# Altium schematic sheet Main_Schematics.SchDoc
size A3; SheetNumber: 1; SheetTotal: 1; SPICEModelCacheYWMZKGYA: <root> / <DocumentId>YWMZKGYA</DocumentId> / <CacheFrame Number="0"> / <Model Name="mcp6021" Kind="CKT"> / <Text>.SUBCKT MCP6021 1 2 3 4 5 / *               | | | | | / *               | | | | Output / *               | | | Negative Supply / *               | | Positive Supply / *               | Inverting Input / *               Non-inverting Input / * / ******************************************************************************** / * Software License Agreement                                                   * / *                                                                              * / * The software supplied herewith by Microchip Technology Incorporated (the     * / * 'Company') is intended and supplied to you, the Company's customer, for use  * / * soley and exclusively on Microchip products.                                 * / *                                                                              * / * The software is owned by the Company and/or its supplier, and is protected   * / * under applicable copyright laws. All rights are reserved. Any use in         * / * violation of the foregoing restrictions may subject the user to criminal     * / * sanctions under applicable laws, as well as to civil liability for the       * / * breach of the terms and conditions of this license.                          * / *                                                                              * / * THIS SOFTWARE IS PROVIDED IN AN 'AS IS' CONDITION. NO WARRANTIES, WHETHER    * / * EXPRESS, IMPLIED OR STATUTORY, INCLUDING, BUT NOT LIMITED TO, IMPLIED        * / * WARRANTIES OF MERCHANTABILITY AND FITNESS FOR A PARTICULAR PURPOSE APPLY TO  * / * THIS SOFTWARE. THE COMPANY SHALL NOT, IN ANY CIRCUMSTANCES, BE LIABLE FOR    * / * SPECIAL, INCIDENTAL OR CONSEQUENTIAL DAMAGES, FOR ANY REASON WHATSOEVER.     * / ******************************************************************************** / * / * The following op-amps are covered by this model: / *      MCP6021,MCP6021R,MCP6022,MCP6023,MCP6024 / * / * Revision History: / *     REV A: 10-Feb-01, KEB (created model) / *     REV B: 27-Aug-06, HNV (added over temperature, improved output stage, / *                            fixed overdrive recovery time) / *			    (MC_RQ, 27-Aug-06, Level 1.17) / * / * Recommendations: / *      Use PSPICE (other simulators may require translation) / *      For a quick, effective design, use a combination of: data sheet / *            specs, bench testing, and simulations with this macromodel / *      For high impedance circuits, set GMIN=100F in the .OPTIONS statement / * / * Supported: / *      Typical performance for temperature range (-40 to 125) degrees Celsius / *      DC, AC, Transient, and Noise analyses. / *      Most specs, including: offsets, DC PSRR, DC CMRR, input impedance, / *            open loop gain, voltage ranges, supply current, ... , etc. / *      Temperature effects for Ibias, Iquiescent, Iout short circuit / *            current, Vsat on both rails, Slew Rate vs. Temp and P.S. / * / * Not Supported: / *      Chip select (MCP6023) / *      Some Variation in specs vs. Power Supply Voltage / *      Monte Carlo (Vos, Ib), Process variation / *      Distortion (detailed non-linear behavior) / *      Behavior outside normal operating region / * / * Input Stage / V10  3 10 -500M / R10 10 11 690K / R11 10 12 690K / G10 10 11 10 11 288U / G11 10 12 10 12 288U / C11 11 12 0.2P / C12  1  0 6.00P / E12 71 14 POLY(4) 20 0 21 0 26 0 27 0   0 1 1 1 1 / G12 1 0 62 0 1m / M12 11 14 15 15 NMI / G13 1 2 62 0 .08m / M14 12 2 15 15 NMI / G14 2 0 62 0 1m / C14  2  0 6.00P / I15 15 4 225.0U / V16 16 4 -300M / GD16 16 1 TABLE {V(16,1)} ((-100,-1p)(0,0)(1m,1u)(2m,1m)) / V13 3 13 -300M / GD13 2 13 TABLE {V(2,13)} ((-100,-1p)(0,0)(1m,1u)(2m,1m)) / R71  1  0 20.0E12 / R72  2  0 20.0E12 / R73  1  2 20.0E12 / I80  1  2 500E-15 / * / * Noise, PSRR, and CMRR / I20 21 20 423U / D20 20  0 DN1 / D21  0 21 DN1 / G26  0 26 POLY(2) 3 0 4 0   0.00 -31.6U -79.4U / R26 26  0 1 / E271 275 0 1 0 1 / E272 276 0 2 0 1 / R271 275 271 37k / R272 276 272 37k / R273 271 0 1k / R274 272 0 1k / C271 275 271 3p / C272 276 272 3p / G27  0 27 POLY(2) 271 0 272 0  -327U 500U 500U / R27 27  0 1 / * / * Open Loop Gain, Slew Rate / G30  0 30 12 11 1 / R30 30  0 1.00K / G31 0 31 3 4 4 / I31 0 31 DC 76.9 / R31 31  0 1 TC=2.34M,-4.57U / GD31 30 0 TABLE {V(30,31)} ((-100,-1n)(0,0)(1m,0.1)(2m,2)) / G32 32 0 3 4 10 / I32 32 0 DC 65 / R32 32  0 1 TC=1.80M,-3.97U / GD32 0 30 TABLE {V(30,32)} ((-2m,2)(-1m,0.1)(0,0)(100,-1n)) / G33  0 33 30 0 1m / R33  33 0 1K / G34  0 34 33 0 1.00 / R34  34 0 1K / C34  34 0 14U / G37  0 37 34 0 1m / R37  37 0 1K / C37  37 0 6P / G38  0 38 37 0 1m / R38  39 0 1K / L38  38 39 31U / E38  35 0 38 0 1 / G35 33 0 TABLE {V(35,3)} ((-1,-1n)(0,0)(50.0,1n))(55.0,1)) / G36 33 0 TABLE {V(35,4)} ((-55.0,-1)((-50.0,-1n)(0,0)(1,1n)) / * / * Output Stage / R80 50 0 100MEG / G50 0 50 57 96 2 / R58 57  96 0.50 / R57 57  0 500 / C58  5  0 2.00P / G57  0 57 POLY(3) 3 0 4 0 35 0   0 0.75M 0.8M 2.00M / GD55 55 57 TABLE {V(55,57)} ((-2m,-1)(-1m,-1m)(0,0)(10,1n)) / GD56 57 56 TABLE {V(57,56)} ((-2m,-1)(-1m,-1m)(0,0)(10,1n)) / E55 55  0 POLY(2) 3 0 51 0 -1.4M 1 -19.1M / E56 56  0 POLY(2) 4 0 52 0 3.5M 1 -19.0M / R51 51 0 1k / R52 52 0 1k / GD51 50 51 TABLE {V(50,51)} ((-10,-1n)(0,0)(1m,1m)(2m,1)) / GD52 50 52 TABLE {V(50,52)}  ((-2m,-1)(-1m,-1m)(0,0)(10,1n)) / G53  3  0 POLY(1) 51 0  -50.0U 1M / G54  0  4 POLY(1) 52 0  -50.0U -1M / * / * Current Limit / G99 96 5 99 0 1 / R98 0 98 1 TC=3.18M,-842N / G97 0 98 TABLE { V(96,5) } ((-11.0,-23.0M)(-1.00M,-22.7M)(0,0)(1.00M,22.7M)(11.0,23.0M)) / E97 99 0 VALUE { V(98)*((V(3)-V(4))*0.00 + 1.00)} / D98 4 5 DESD / D99 5 3 DESD / * / * Temperature / Voltage Sensitive IQuiscent / R61 0 61 1 TC=2.62M,-1.92U / G61 3 4 61 0 1 / G60 0 61 TABLE {V(3, 4)} / + ((0,0)(900M,9.2U)(1.1,50U)(1.3,240U) / + (2.1,870U)(2.2,900U)(5.5,980U)) / * / * Temperature Sensistive offset voltage / I73 0 70 DC 1uA / R74 0 70 1 TC=3.5 / E75 1 71 70 0 1 / * / * Temp Sensistive IBias / I62 0 62 DC 1uA / R62 0 62 REXP  245U / * / * Models / .MODEL NMI NMOS(L=2.00U W=42.0U KP=20.0U LEVEL=1 ) / .MODEL DESD  D   N=1 IS=1.00E-15 / .MODEL DN1 D   IS=1P KF=12.5F AF=1 / .MODEL REXP RES TCE= 9.16 / .ENDS MCP6021</Text> / </Model> / </CacheFrame> / </root>
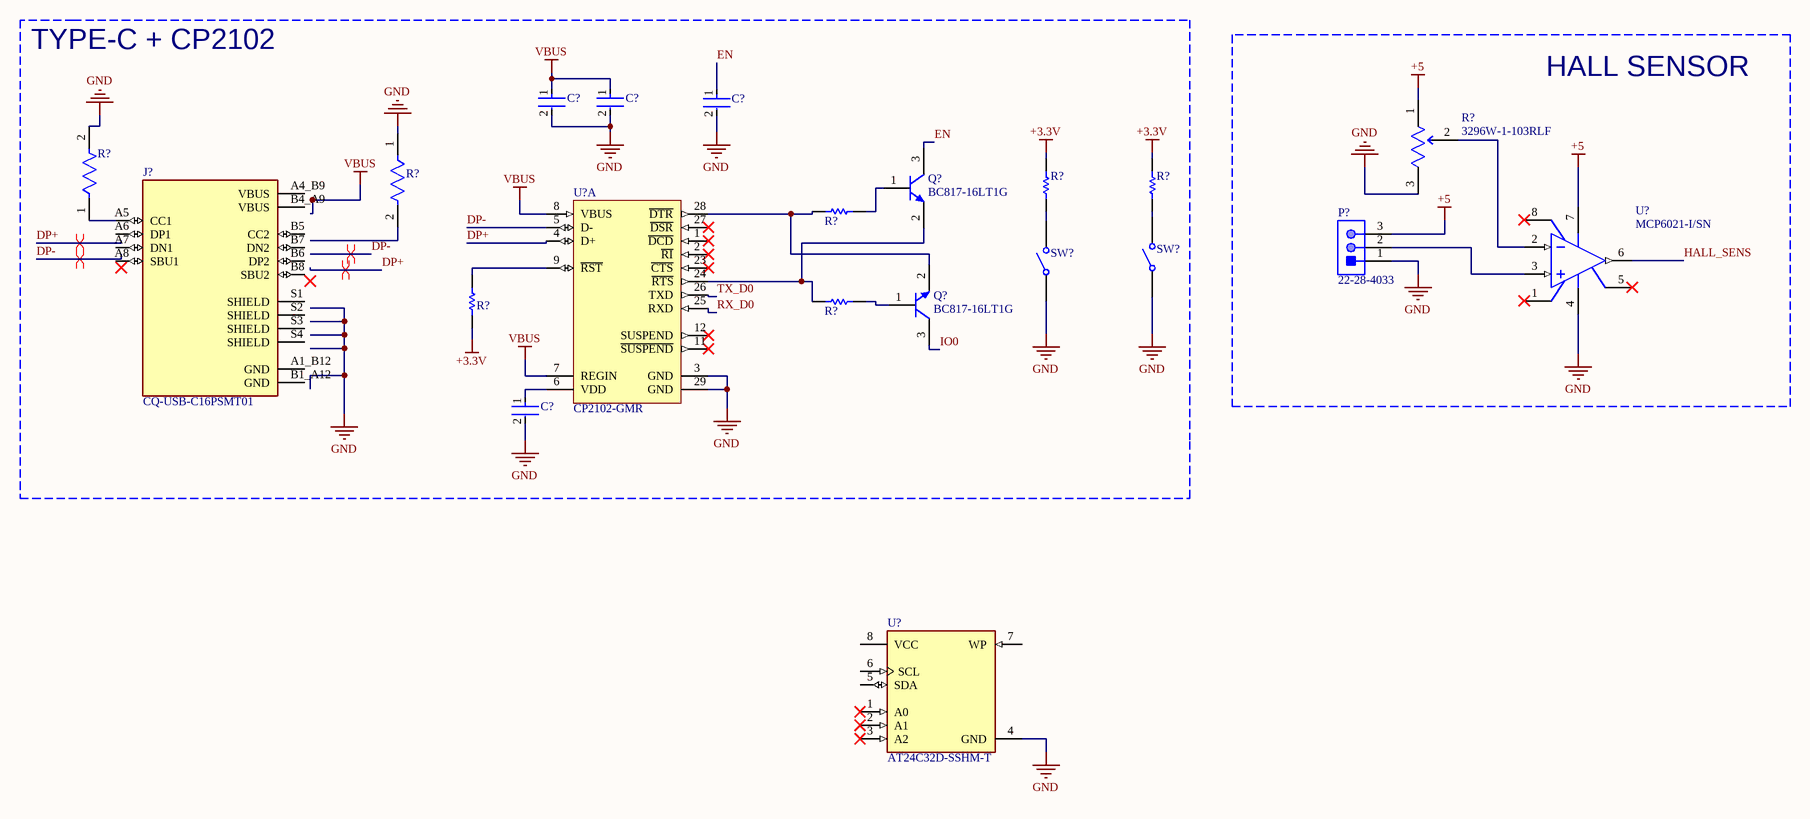
[diagram p0: Main_Schematics.SchDoc]

## Parts
(Parts that share a designator on the sheet are numbered #1, #2 ... from top to bottom, then left to right.)
C?#1  CGA3E2X7R1H104K080AA  [FP-CGA3E-0_3-0_1-IPC_A]  (value not drawn)
C?#2  C0603C475K9PACTU  [FP-C0603-CG-MFG]  (value not drawn)
C?#3  CGA3E2X7R1H104K080AA  [FP-CGA3E-0_3-0_1-IPC_A]  (value not drawn)
C?#4  CGA3E2X7R1H104K080AA  [FP-CGA3E-0_3-0_1-IPC_A]  (value not drawn)
J?  CQ-USB-C16PSMT01  [SHENZHEN-CHUANGQIN-TECHNOLOGY_CQ-USB-C16PSMT01]
P?  22-28-4033  [MOLX-22-28-4033_V]
Q?#1  BC817-16LT1G  [ONSC-SOT-23-3-318-08_V]
Q?#2  BC817-16LT1G  [ONSC-SOT-23-3-318-08_V]
R?#1  3296W-1-103RLF  [FP-3296W-MFG]
R?#2  CRCW06035K10FKEA  [FP-CRCW0603-e3-IPC_C]  (value not drawn)
R?#3  ERJ3EKF1002V  [RESC1609X55X30LL15T15]  (value not drawn)
R?#4  ERJ3EKF1002V  [RESC1609X55X30LL15T15]  (value not drawn)
R?#5  ERJ3EKF1002V  [RESC1609X55X30LL15T15]  (value not drawn)
R?#6  CRCW06035K10FKEA  [FP-CRCW0603-e3-IPC_C]  (value not drawn)
R?#7  ERJ3EKF1002V  [RESC1609X55X30LL15T15]  (value not drawn)
R?#8  ERJ3EKF1002V  [RESC1609X55X30LL15T15]  (value not drawn)
SW?#1  434121043816  [434121043816]  (value not drawn)
SW?#2  434121043816  [434121043816]  (value not drawn)
U?#1  CP2102-GMR  [SLAB-QFN-28-3125x3125TP_M]  (part A of 2)
U?#2  MCP6021-I/SN  [SOIC-SN8_L]
U?#3  AT24C32D-SSHM-T  [FP-C04-057-SN-IPC_C]

## Blocks framed on the sheet
TYPE-C + CP2102: C?#1-C?#4 J? Q?#1 Q?#2 R?#2-R?#8 SW?#1 SW?#2 U?#1
HALL SENSOR: P? R?#1 U?#2

## Nets
+3.3V: R?#3.2 R?#4.2 R?#8.1
+5: P?.3 R?#1.1(CCW) U?#2.7(VDD)
GND: C?#1.2 C?#2.2 C?#3.2 C?#4.2 P?.1 R?#1.3(CW) R?#2.1 R?#6.2 SW?#1.1 SW?#2.1 U?#1.3(GND) U?#1.29(GND) U?#2.4(VSS) U?#3.4(GND)
VBUS: C?#1.1 C?#2.1 U?#1.7(REGIN) U?#1.8(VBUS)
DP+: U?#1.4(D+)
DP-: U?#1.5(D-)
EN: C?#3.1 Q?#1.3(C)
HALL_SENS: U?#2.6(VOUT)
IO0: Q?#2.3(C)
RX_D0: U?#1.25(RXD)
TX_D0: U?#1.26(TXD)
NetC?#4_1: C?#4.1 U?#1.6(VDD)
NetJ?_A5: J?.A5(CC1) R?#6.1
NetP?_2: P?.2 U?#2.3(VIN+)
NetQ?#1_1: Q?#1.1(B) R?#5.1
NetQ?#1_2: Q?#1.2(E) R?#7.2 U?#1.24(~{RTS})
NetQ?#2_1: Q?#2.1(B) R?#7.1
NetQ?#2_2: Q?#2.2(E) R?#5.2 U?#1.28(~{DTR})
NetR?#1_2: R?#1.2(WIPER) U?#2.2(VIN-)
NetR?#3_1: R?#3.1 SW?#2.2
NetR?#4_1: R?#4.1 SW?#1.2
NetR?#8_2: R?#8.2 U?#1.9(~{RST})

Not connected (* = marked no-connect by the designer): J? A1_B12(GND) A4_B9(VBUS) A6(DP1) A7(DN1) A8(SBU1) B1_A12(GND) B4_A9(VBUS) B5(CC2) B6(DP2) B7(DN2) B8(SBU2) S1(SHIELD) S2(SHIELD) S3(SHIELD) S4(SHIELD); R?#2 2; U?#1 1(~{DCD})* 2(~{RI})* 11(~{SUSPEND})* 12(SUSPEND)* 23(~{CTS})* 27(~{DSR})*; U?#2 1(NC)* 5(VREF)* 8(NC)*; U?#3 1(A0)* 2(A1)* 3(A2)* 5(SDA) 6(SCL) 7(WP) 8(VCC)

## Layout directives
differential pair: DP+, DP-

## Library data of the parts
C?#1 C?#3 C?#4 = CMP-2000-07546-2: Cap Ceramic 100nF 50V X7R 10% Pad SMD 0603 +125°C Automotive T/R; Weight: 7.1E-05oz; Composition: Ceramic; Max Operating Temperature: 125°C; Termination: SMD/SMT; Dielectric: X7R; Length: 1.6mm; Package Quantity: 1; REACH SVHC: No SVHC; Lead Free: Lead Free; Case Code (Metric): 1608; Min Operating Temperature: -55°C; Packaging: Tape and Reel; Tolerance: 10%; Voltage Rating: 50V; Case Code (Imperial): 0603; Capacitance: 100nF; Case/Package: 0603; Voltage Rating (DC): 50V; Depth: 0.8mm; Radiation Hardening: No; Ratings: AEC-Q200; Mount: Surface Mount; Voltage: 50V; Thickness: 0.035inch; Width: 0.8mm; Height: 0.8mm
C?#2 = CMP-2006-02256-2: CAP CER 4.7UF 6.3V X5R 0603; Manufacturer: Kemet; Temperature Coefficient: 15%; Tolerance: 10%; Material: Ceramic; Device Class L3: Ceramic Capacitors; RoHS: TRUE; Value: 4.7uF; Lead Free: Yes; ComponentLink2Description: Datasheet; Mouser Description: Multilayer Ceramic Capacitors MLCC - SMD/SMT 6.3volts 4.7uF X5R 10%; Package: C0603-CG; Digikey Description: CAP CER 4.7UF 6.3V X5R 0603; ComponentLink2URL: https://content.kemet.com/datasheets/KEM_C1006_X5R_SMD.pdf; Category: Cap; Temperature Range Low: -55°C; Capacitance: 4.7uF; Temperature: -55°C to +85°C; Octopart: https://octopart.com/c0603c475k9pactu-kemet-104242; Ipc Land Pattern Name: CAPC16080X80; Voltage Rating: 6.3V; Temperature Range High: +85°C; Height: 0.9mm; Temperature Characteristic: X5R; Device Class L1: Passive Components; Manufacturer Part Number: C0603C475K9PACTU; Automotive: No; Device Class L2: Capacitors
J? = CQ-USB-C16PSMT01: C Type USB Type-C Female Plug 16 Pin Connector Power Charger Jack Port; MF: Shenzen Chuangqin Technology; MP: CQ-USB-C16PSMT01; Price: None; Package: Package; Availability: Unavailable; SnapEDA_Link: https://www.snapeda.com/parts/CQ-USB-C16PSMT01/Shenzen%20Chuangqin%20Technology/view-part/5798994/?ref=snap; Check_prices: https://www.snapeda.com/parts/CQ-USB-C16PSMT01/Shenzen%20Chuangqin%20Technology/view-part/5798994/?ref=eda; Value: *
P? = CMP-1676-00001-5: Male Header, Pitch 2.54 mm, 1 x 3 Position, Height 8.38 mm, Tail Length 3.18 mm, RoHS, Bulk; Manufacturer: Molex; Rows: 1; Voltage Rating: 250 V; Current Rating: 4 A; Min Operating Temperature: 0 degC; Lead Pitch: 0.1 inch; Packaging: Bulk; Contact Finish: Gold; RoHSCompliant: true; Contact Material: Brass; PackageReference: 22-28-4033; REACH SVHC: Unknown; PackageDescription: Male Header, Pitch 2.54 mm, 1 x 3 Position, Height 8.38 mm, Tail Length 3.18 mm; ComponentLink2URL: http://www.molex.com/pdm_docs/sd/022284033_sd.pdf; Height: 8.38 mm; Mounting Technology: Through Hole; ComponentLink1Description: Manufacturer URL; Length: 7.62 mm; Mount: Through Hole; DatasheetVersion: Rev. G, 01/2012; Max Operating Temperature: 75 degC; ComponentLink2Description: Datasheet; Colour: Black; Pins: 3; Contact Plating: Gold; Package Quantity: 1; ComponentLink1URL: http://www.molex.com/
Q?#1 Q?#2 = CMP-1048-00736-1: General Purpose Transistor, NPN Silicon, 3-Pin SOT-23, Pb-Free, Tape and Reel; Manufacturer: On Semiconductor; IC Continuous (A): 0.5; fT Min (MHz): 100; PartNumber: BC817-16LT1G; Mounting Technology: Surface Mount; PackageVersion: Rev. AP, 11/2009; ComponentLink3Description: Package Specification; PackageReference: SOT-23-3-318-08; Packing: Tape and Reel; ComponentLink1URL: http://www.onsemi.com/; Polarity: NPN; RoHS: TRUE; ComponentLink2URL: http://www.onsemi.com/pub_link/Collateral/BC817-16LT1-D.PDF; ComponentLink3URL: http://www.onsemi.cn/pub_link/Collateral/318-08.PDF; ComponentLink2Description: Datasheet; PackageDescription: 3-Pin Small Outline Transistor, Body 2.92 x 1.3 mm, Pitch 0.95 mm; ComponentLink1Description: Manufacturer URL; DatasheetVersion: Rev. 12
R?#1 = CMP-07234-000024-1: TRIMMER 10K OHM 0.5W PC PIN TOP; Resistance: 10kR; Temperature Coefficient: 100ppm/°C; Power Rating: 500mW; Tolerance: 10%; Number of Turns: 25; Width: 0.19inch; Termination: Pin; Radiation Hardening: No; Contact Plating: Tin; Composition: Cermet; Length: 9.53mm; Height: 0.395inch; Depth: 4.83mm; REACH SVHC: No SVHC; Weight: 0.03oz; Min Operating Temperature: -55°C; Military Standard: Not; Max Operating Temperature: 125°C; Packaging: Tape and Reel; Package Quantity: 1; Taper: Linear; Max Power Dissipation: 500mW; Mount: Through Hole
R?#2 R?#6 = CMP-1012-00590-3: RES Thick Film, 5.1kΩ, 1%, 0.1W, 100ppm/°C, 0603; Power Rating: 100mW; Voltage Rating (DC): 75V; Resistance: 5.1kR; Width: 0.85mm; Depth: 0.85mm; Military Standard: Not; Package Quantity: 5000; Case Code (Metric): 1608; Length: 1.55mm; Weight: 7.1E-05oz; Packaging: Tape and Reel; Temperature Coefficient: 100ppm/°C; Case Code (Imperial): 0603; Lead Free: Lead Free; Radiation Hardening: No; Contact Plating: Tin; Composition: Thick Film; Max Operating Temperature: 155°C; Termination: SMD/SMT; Case/Package: 0603; Min Operating Temperature: -55°C; Tolerance: 1%; Voltage Rating: 75V; Mount: Surface Mount; Height: 0.45mm
R?#3-R?#5 R?#7 R?#8 = CMP-1012-00623-3: Chip Resistor, 10 KOhm, +/- 1%, 0.1 W, -55 to 155 degC, 0603 (1608 Metric), RoHS, Tape and Reel; Manufacturer: Panasonic; Voltage Rating: 75V; Case\/Package: 0603; Power Rating: 100mW; Resistance: 10KOhm; Temperature Coefficient: 100ppm\/degreesC; Number of Pins: 2; Package Reference: 603; Depth: 0.8mm; Mount: SurfaceMount; Package Description: 2-Pin Surface Mount Device, Body 1.6 x 0.85 mm; Datasheet Version: 02/2017; Length: 1.6mm; Lead Free: LeadFree; Height: 0.45mm; Number of Terminations: 2; Max Power Dissipation: 100mW; Min Operating Temperature: -55degC; Datasheet URL: https://industrial.panasonic.com/cdbs/www-data/pdf/RDA0000/AOA0000C304.pdf; Termination: SMD/SMT; Case Code (Metric): 1608; Case Code (Imperial): 0603; Tolerance: 1%; Max Operating Temperature: 155degC; RoHSCompliant: true; Voltage Rating (DC): 75V; Radiation Hardening: No; Packaging: TapeandReel; Composition: ThickFilm; Mounting Technology: SurfaceMount; Manufacturer URL: http://www.panasonic.com/; Width: 0.031inch; REACH SVHC: NoSVHC; Contact Plating: Tin; Military Standard: Not; Package Quantity: 1
SW?#1 SW?#2 = CMP-1459-00005-1: WS-TASV SMD Tact Switch 6.0X3.5 mm; Manufacturer: Wuerth Elektronik; NoPins: 02; ComponentLink1URL: http://www.we-online.com; PartNumber: 434121043816; ComponentLink2URL: http://katalog.we-online.de/em/datasheet/434121043816.pdf; ComponentLink2Description: Datasheet; ComponentLink1Description: Manufacturer URL; PackageReference: 434121043816
U?#1 = CMP-2000-04924-1: Single-Chip USB to URAT Bridge, 3.3 V, -40 to 85 degC, 28-Pin QFN, RoHS, Tape and Reel; Manufacturer: Silicon Labs; Interface Circuit Standard 1: RS-232; Transmitter and Receiver FIFO Counter: No; Supply Current: 26mA; Operating Supply Voltage (Min): 3V; Operating Supply Voltage (Typ): 3.3V; Data Rate: 1000kbps; Operating Supply Voltage (Max): 3.6V; Number of Channels: 1; Package URL: http://www.silabs.com/Support%20Documents/TechnicalDocs/C8051T61x.pdf; Operating Temperature (Max): 85C; Datasheet URL: http://www.mouser.com/ds/2/368/CP2102-9-247052.pdf; Operating Temperature Classification: Industrial; Operating Temperature (Min): -40C; Package Description: 28-Pin Quad-Flat No-Leads Package, Body 5 x 5 mm, Pitch 0.5 mm; Manufacturer URL: http://www.silabs.com/; Rad Hardened: No; Package Reference: QFN-28; Pin Count: 28; Packaging: TapeandReel; Mounting: SurfaceMount; Package Type: QFNEP; Datasheet Version: Rev. 1.6, 12/2013
U?#2 = CMP-0187-00372-3: None; Bandwidth: 10MHz; Input Offset Voltage-Max: 500uV; Output Current: 22mA; Number of Channels: 1; Min Supply Voltage: 2.5V; Supply Current: 1mA; Voltage Gain: 110dB; Input Bias Current: 150pA; Slew Rate-Nom: 7V/µs; Common Mode Rejection Ratio: 70dB; Power Supply Rejection Ratio (PSRR): 74dB; Amplifier Type: GENERAL PURPOSE; Max Supply Voltage: 5.5V; Length: 0.192inch; Max Operating Temperature: 85°C; RoHS Compliant: Yes; Width: 0.154inch; Harmonic Distortion: 0.00053%; Gain Bandwidth Product: 10MHz; Input Offset Voltage (Vos): 500uV; Mount: Surface Mount; Number of Pins: 8; Unity Gain Bandwidth Product: 10MHz; Number of Amplifiers: 1; Technology: CMOS; Slew Rate: 7V/µs; Lead Free: Lead Free; Case/Package: SOIC; Radiation Hardening: No; Number of Elements: 1; Number of Circuits: 1; Package Quantity: 100; Min Operating Temperature: -40°C; Nominal Supply Current: 1mA; Height: 0.049inch; Packaging: Rail/Tube; REACH SVHC: No SVHC
U?#3 = CMP-06313-000048-1: IC EEPROM 32K I2C 1MHZ 8SOIC; Memory Type: Non-Volatile; Memory Size: 32Kb; Access Time: 550ns; Frequency: 1MHz; Max Operating Temperature: 85°C; Number of Pins: 8; Packaging: Tape and Reel; Min Operating Temperature: -40°C; Case/Package: SOIC; Mount: Surface Mount